# Altium schematic sheet Safety Loop.SchDoc
size A4; SheetNumber: 4; SheetTotal: 11
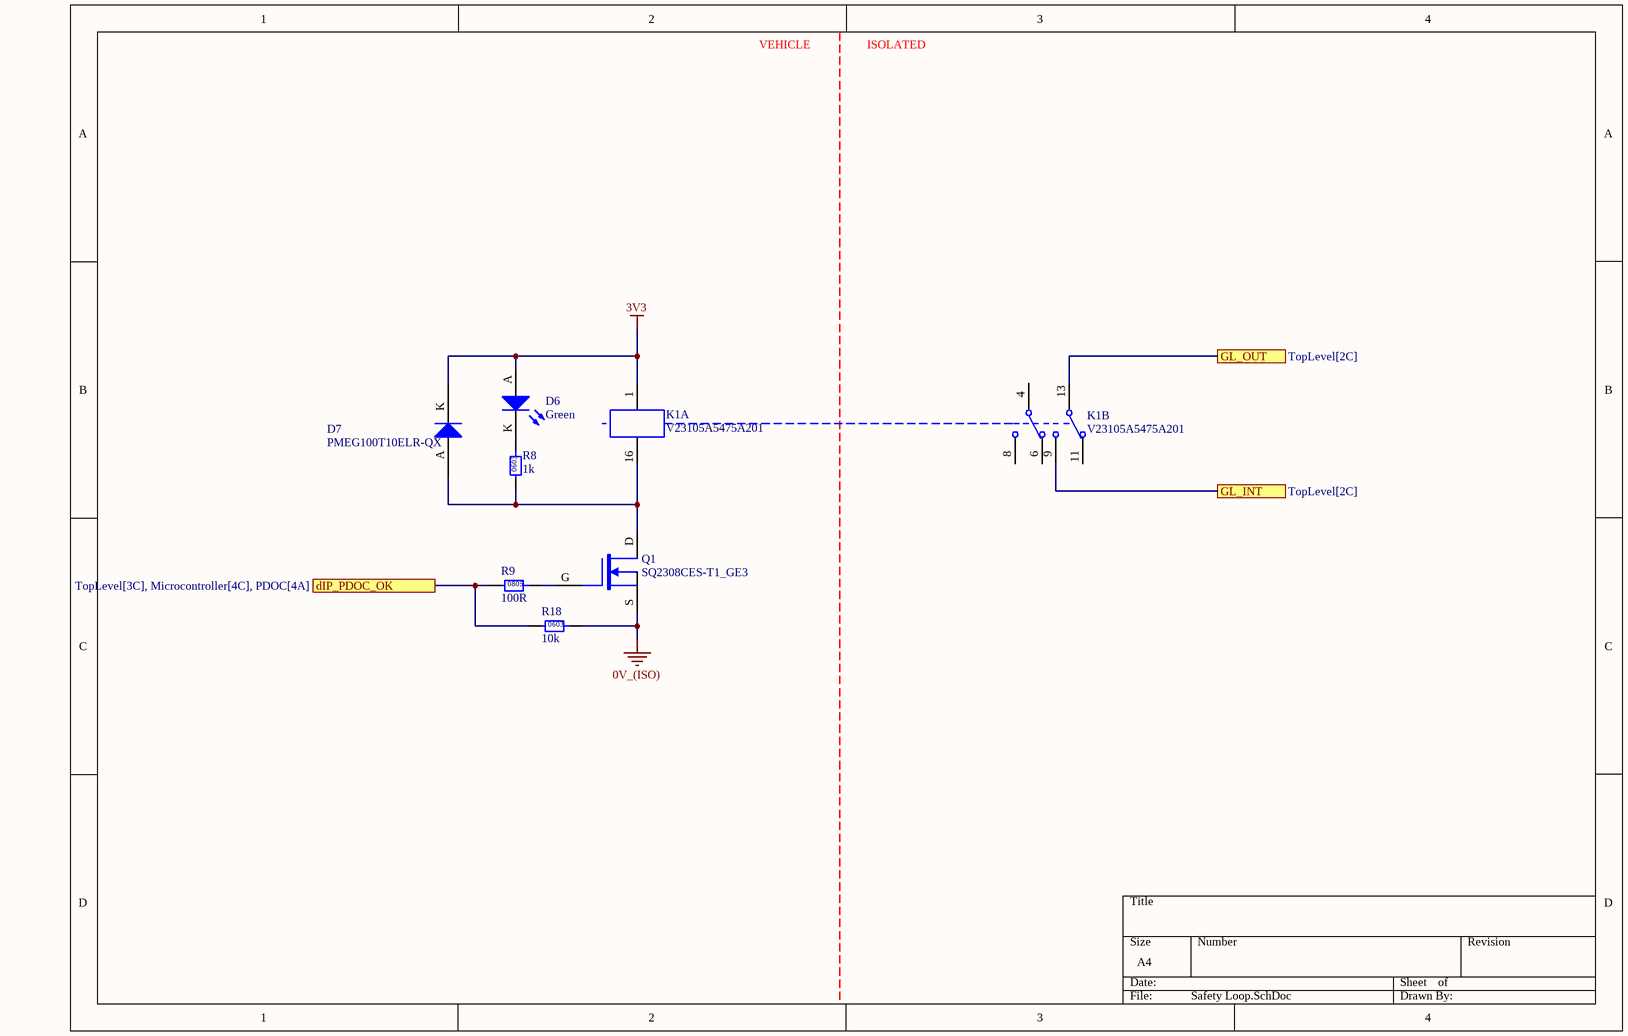
[diagram p0: Safety Loop.SchDoc]

## Parts
D6  Green  [0805 LED]
D7  PMEG100T10ELR-QX  [SODFL350X110-2N]
K1  V23105A5475A201  [TI 2-DIL]  (parts A,B of 2)
Q1  SQ2308CES-T1_GE3  [VSHY SOT-23-3]
R8  1k  [0603]
R9  100R  [0805]
R18  10k  [0603]

## Ports
dIP_PDOC_OK (see TopLevel[3C], Microcontroller[4C], PDOC[4A]), GL_INT (see TopLevel[2C]), GL_OUT (see TopLevel[2C])

## Nets
0V_(ISO): Q1.S R18.2
3V3: D6.A D7.K K1.1
dIP_PDOC_OK: R9.1 R18.1 ; port dIP_PDOC_OK
GL_INT: K1.9 ; port GL_INT
GL_OUT: K1.13 ; port GL_OUT
NetD6_K: D6.K R8.2
NetD7_A: D7.A K1.16 Q1.D R8.1
NetQ1_G: Q1.G R9.2

Not connected (* = marked no-connect by the designer): K1 4 6 8 11

## Notes on the sheet
- VEHICLE
- ISOLATED
- (in symbol RC0603FR-071KL) 0603
- (in symbol RC0603FR-0710KL) 0603
- (in symbol RC0805FR07100RL) 0805

## Library data of the parts
D6 = SML-210FTT86: Green LED Indication - Discrete 1.75V 0805 (2012 Metric); Manufacturer: ROHM Semiconductor; Part Number: SML-210FTT86; Colour: Green; Digikey Part Number: 511-1285-1-ND
D7 = CMP-004-00005-4: Diode 100 V 1A Surface Mount SOD-123W
K1 = CMP-036-000001-1: 5V DPDT Relay 3A 220VDC; Part Number: V23105A5475A201
Q1 = SQ2308CES-T1_GE3: MOSFET N-CH 60V 2.3A SOT23; Manufacturer: Vishay Siliconix; Type: N-channel; Rated Power: 2W; Published: 24-Mar-1999; LatestRevisionDate: 29-May-2009; LatestRevisionNote: IPC-7351 Footprint Added.; PackageVersion: Sep-2000; PackageReference: SOT-343; Publisher: Altium Limited; PackageDescription: 4-Pin SOT-343 Package 1.3 mm Pitch, 2.1 mm Lead Span; Part Number: SQ2308CES-T1_GE3; Digikey Part Number: SQ2308CES-T1_GE3CT-ND
R8 = RC0603FR-071KL: Manufacturer: YAGEO; Tolerance: 0.01; Rated Power: 0.1W; Part Number: RC0603FR-071KL; Value: 1k; Digikey Part Number: 311-1.00KHRCT-ND; Material: FR-07
R9 = RC0805FR07100RL: Manufacturer: YAGEO; Tolerance: 0.01; Rated Power: 0.125W; Part Number: RC0805FR07100RL; Value: 100R; Material: FR-07; Digikey Part Number: 311-100CRCT-ND
R18 = RC0603FR-0710KL: Manufacturer: YAGEO; Tolerance: 0.01; Rated Power: 0.1W; Part Number: RC0603FR-0710KL; Value: 10k; Material: FR-07; Digikey Part Number: 311-10.0KHRCT-ND